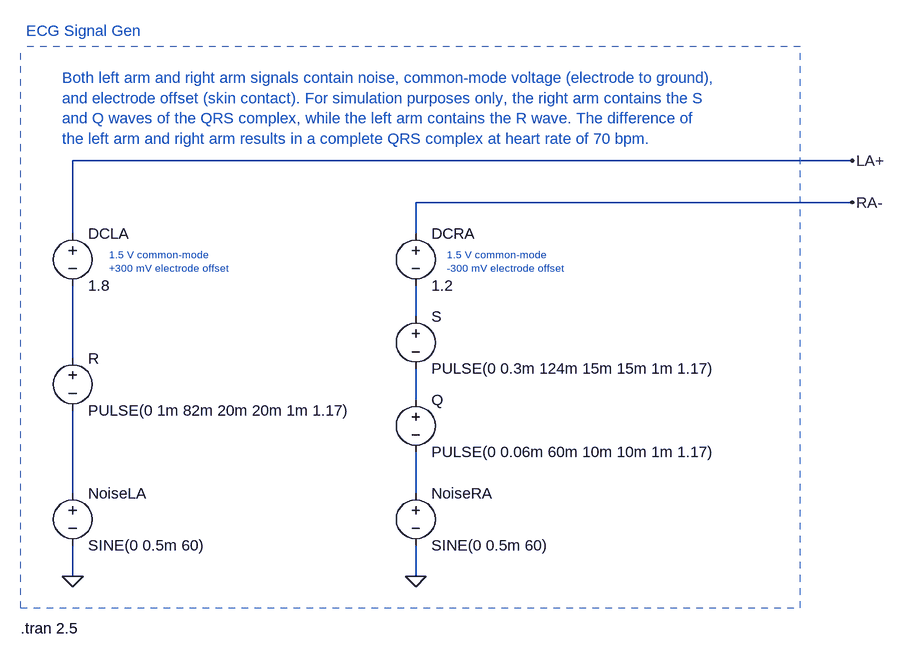
[diagram p0: schematic QRS_wave_gen.asc]
QRS_wave_gen.asc, the LTspice schematic file:
Version 4
SHEET 1 1332 680
WIRE 48 -688 -1152 -688
WIRE 48 -624 -624 -624
WIRE -1152 -576 -1152 -688
WIRE -624 -576 -624 -624
WIRE -624 -448 -624 -496
WIRE -1152 -384 -1152 -496
WIRE -624 -320 -624 -368
WIRE -1152 -176 -1152 -304
WIRE -624 -176 -624 -240
WIRE -1152 -48 -1152 -96
WIRE -624 -48 -624 -96
FLAG 48 -624 RA-
FLAG 48 -688 LA+
FLAG -624 -48 0
FLAG -1152 -48 0
SYMBOL voltage -1152 -400 R0
SYMATTR InstName R
SYMATTR Value PULSE(0 1m 82m 20m 20m 1m 1.17)
SYMBOL voltage -1152 -592 R0
SYMATTR InstName DCLA
SYMATTR Value 1.8
SYMBOL voltage -624 -336 R0
WINDOW 123 0 0 Left 0
WINDOW 39 0 0 Left 0
SYMATTR InstName Q
SYMATTR Value PULSE(0 0.06m 60m 10m 10m 1m 1.17)
SYMBOL voltage -624 -464 R0
SYMATTR InstName S
SYMATTR Value PULSE(0 0.3m 124m 15m 15m 1m 1.17)
SYMBOL voltage -624 -592 R0
SYMATTR InstName DCRA
SYMATTR Value 1.2
SYMBOL voltage -624 -192 R0
WINDOW 123 0 0 Left 0
WINDOW 39 0 0 Left 0
SYMATTR InstName NoiseRA
SYMATTR Value SINE(0 0.5m 60)
SYMBOL voltage -1152 -192 R0
WINDOW 123 0 0 Left 0
WINDOW 39 0 0 Left 0
SYMATTR InstName NoiseLA
SYMATTR Value SINE(0 0.5m 60)
TEXT -1168 -816 Left 2 ;Both left arm and right arm signals contain noise, common-mode voltage (electrode to ground),\nand electrode offset (skin contact). For simulation purposes only, the right arm contains the S \nand Q waves of the QRS complex, while the left arm contains the R wave. The difference of \nthe left arm and right arm results in a complete QRS complex at heart rate of 70 bpm.
TEXT -1224 -888 Left 2 ;ECG Signal Gen
TEXT -1232 32 Left 2 !.tran 2.5
TEXT -1096 -544 Left 1 ;1.5 V common-mode\n+300 mV electrode offset
TEXT -576 -544 Left 1 ;1.5 V common-mode\n-300 mV electrode offset
LINE Normal -32 -864 -1232 -864 2
LINE Normal -1232 0 -32 0 2
LINE Normal -1232 0 -1232 -864 2
LINE Normal -32 0 -32 -864 2

The netlist it stands for:
* QRS_wave_gen.asc
V§R N002 N004 PULSE(0 1m 82m 20m 20m 1m 1.17)
V§DCLA LA+ N002 1.8
V§Q N003 N005 PULSE(0 0.06m 60m 10m 10m 1m 1.17)
V§S N001 N003 PULSE(0 0.3m 124m 15m 15m 1m 1.17)
V§DCRA RA- N001 1.2
V§NoiseRA N005 0 SINE(0 0.5m 60)
V§NoiseLA N004 0 SINE(0 0.5m 60)
* Both left arm and right arm signals contain noise, common-mode voltage (electrode to ground),
* and electrode offset (skin contact). For simulation purposes only, the right arm contains the S
* and Q waves of the QRS complex, while the left arm contains the R wave. The difference of
* the left arm and right arm results in a complete QRS complex at heart rate of 70 bpm.
* ECG Signal Gen
.tran 2.5
* 1.5 V common-mode
* +300 mV electrode offset
* 1.5 V common-mode
* -300 mV electrode offset
.backanno
.end